# Altium schematic sheet Bullseye Volume Board Rev 0.0.3.SchDoc
size A4; DrawnBy: Kevin Zhou; Revision: 0.0.3; Status: DP1; Size: A4
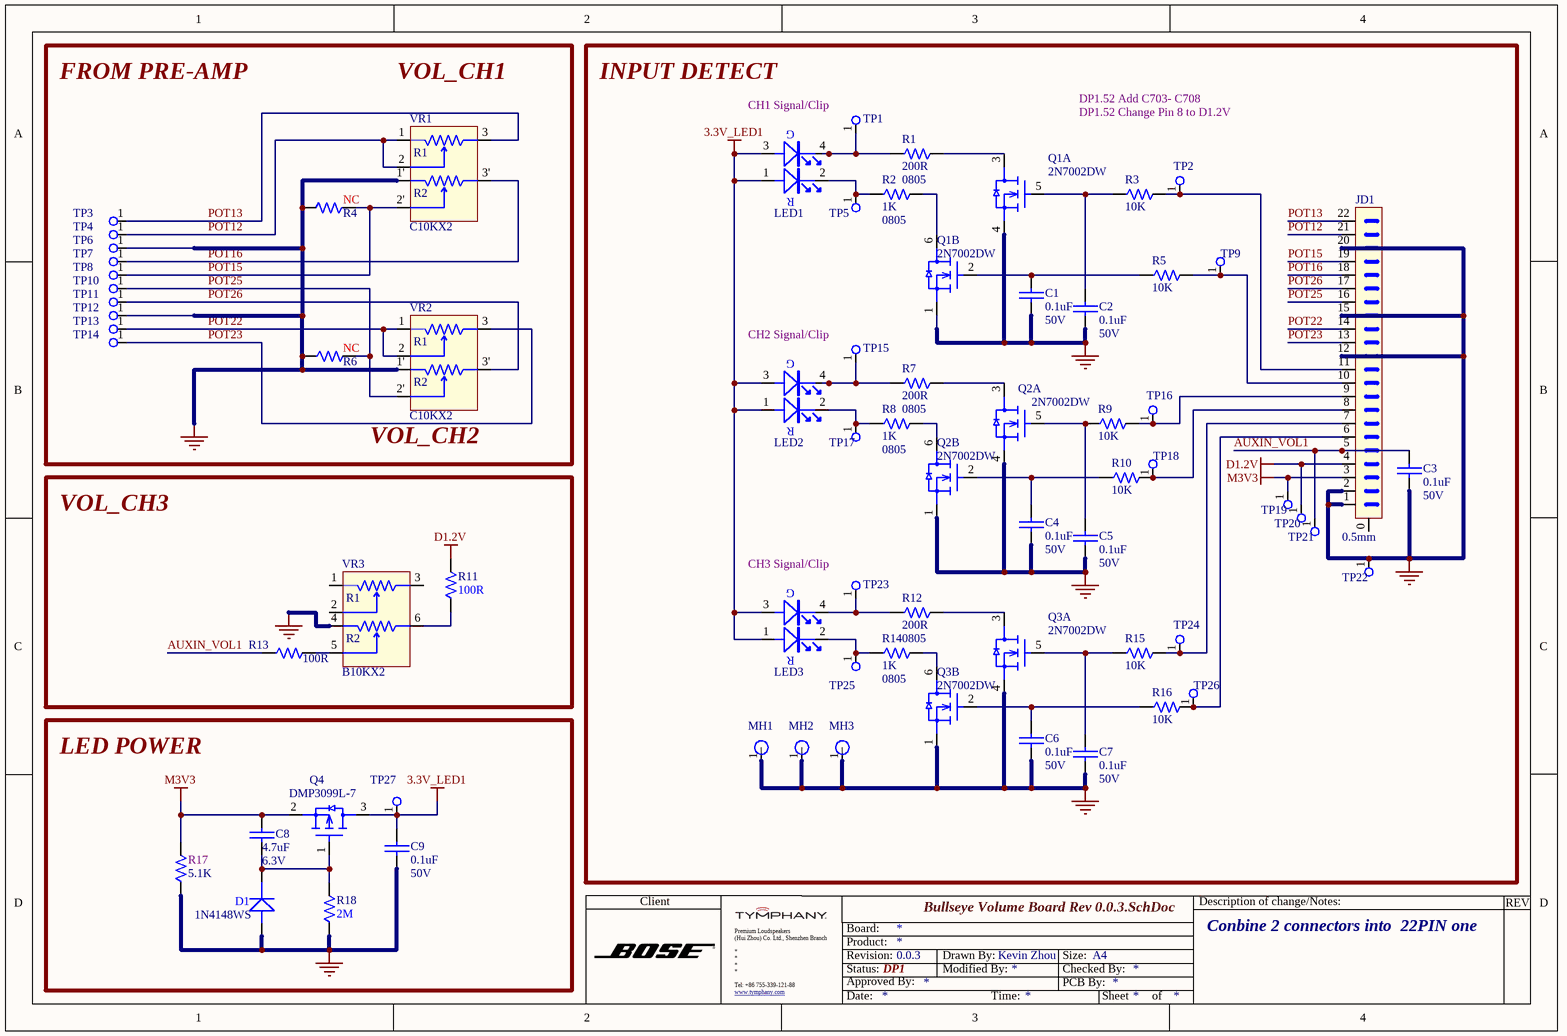
[diagram p0: Bullseye Volume Board Rev 0.0.3.SchDoc]

## Parts
C1  value 0.1uF  Voltage: 50V  [CAPC0402-RW]  (hidden comment: PWL456470-1040)
C2  value 0.1uF  Voltage: 50V  [CAPC0402-RW]  (hidden comment: PWL456470-1040)
C3  value 0.1uF  Voltage: 50V  [CAPC0402-RW]  (hidden comment: PWL456470-1040)
C4  value 0.1uF  Voltage: 50V  [CAPC0402-RW]  (hidden comment: PWL456470-1040)
C5  value 0.1uF  Voltage: 50V  [CAPC0402-RW]  (hidden comment: PWL456470-1040)
C6  value 0.1uF  Voltage: 50V  [CAPC0402-RW]  (hidden comment: PWL456470-1040)
C7  value 0.1uF  Voltage: 50V  [CAPC0402-RW]  (hidden comment: PWL456470-1040)
C8  value 4.7uF  Voltage: 6.3V  [CAPC0603-RW]  (hidden comment: PXL456420-4750)
C9  value 0.1uF  Voltage: 50V  [CAPC0603-RW]  (hidden comment: PXL456470-1040)
D1  RCD114148-0020  [SOD-323]  (value not drawn)
JD1  value 0.5mm  [CONN FFC 22P PH=0.5mm SMT RA 0.5S-1X-22PWT-5.4R]  (hidden comment: T690300139200)
LED1  KCD250001-0010  [SMTLED2.0*1.25-RGB]  (value not drawn)
LED2  KCD250001-0010  [SMTLED2.0*1.25-RGB]  (value not drawn)
LED3  KCD250001-0010  [SMTLED2.0*1.25-RGB]  (value not drawn)
MH1  MHOLE 3MM  [MHOLE 3.5MM W/Vias]  (value not drawn)
MH2  MHOLE 3MM  [MHOLE 3.5MM W/Vias]  (value not drawn)
MH3  MHOLE 3MM  [MHOLE 3.5MM W/Vias]  (value not drawn)
Q1  RCM027002-1001  [SOT-363]  (value not drawn)  (parts A,B of 2)
Q2  RCM027002-1001  [SOT-363]  (value not drawn)  (parts A,B of 2)
Q3  RCM027002-1001  [SOT-363]  (value not drawn)  (parts A,B of 2)
Q4  T585002550438  [SOT23-132-RW]  (value not drawn)
R1  value 200R  PACKAGE: 0805  [0805-RW]  (hidden comment: QCF081020-2000)
R2  value 1K  PACKAGE: 0805  [0805-RW]  (hidden comment: QCF081020-1001)
R3  value 10K  [0402-RW]  (hidden comment: QCF161240-1002)
R4  value NC  [0603-RW]  (hidden comment: RES0603 NC)
R5  value 10K  [0402-RW]  (hidden comment: QCF161240-1002)
R6  value NC  [0603-RW]  (hidden comment: RES0603 NC)
R7  value 200R  PACKAGE: 0805  [0805-RW]  (hidden comment: QCF081020-2000)
R8  value 1K  PACKAGE: 0805  [0805-RW]  (hidden comment: QCF081020-1001)
R9  value 10K  [0402-RW]  (hidden comment: QCF161240-1002)
R10  value 10K  [0402-RW]  (hidden comment: QCF161240-1002)
R11  value 100R  [0402-RW]  (hidden comment: QCF161240-1000)
R12  value 200R  PACKAGE: 0805  [0805-RW]  (hidden comment: QCF081020-2000)
R13  value 100R  [0402-RW]  (hidden comment: QCF161240-1000)
R14  value 1K  PACKAGE: 0805  [0805-RW]  (hidden comment: QCF081020-1001)
R15  value 10K  [0402-RW]  (hidden comment: QCF161240-1002)
R16  value 10K  [0402-RW]  (hidden comment: QCF161240-1002)
R17  value 5.1K  [0603-RW]  (hidden comment: QCF011030-5101)
R18  value 2M  [0402-RW]  (hidden comment: T502200401399)
TP1  CH1_GN  [TP_1.2mm]  (value not drawn)
TP2  CH1_SIG  [TP_1.2mm]  (value not drawn)
TP3  CH1_GN  [TP_1.2mm]  (value not drawn)
TP4  CH1_GN  [TP_1.2mm]  (value not drawn)
TP5  CH1_RED  [TP_1.2mm]  (value not drawn)
TP6  CH1_GN  [TP_1.2mm]  (value not drawn)
TP7  CH1_GN  [TP_1.2mm]  (value not drawn)
TP8  CH1_GN  [TP_1.2mm]  (value not drawn)
TP9  CH1_LIM  [TP_1.2mm]  (value not drawn)
TP10  CH1_GN  [TP_1.2mm]  (value not drawn)
TP11  CH1_GN  [TP_1.2mm]  (value not drawn)
TP12  CH1_GN  [TP_1.2mm]  (value not drawn)
TP13  CH1_GN  [TP_1.2mm]  (value not drawn)
TP14  CH1_GN  [TP_1.2mm]  (value not drawn)
TP15  CH1_GN  [TP_1.2mm]  (value not drawn)
TP16  CH1_SIG  [TP_1.2mm]  (value not drawn)
TP17  CH1_RED  [TP_1.2mm]  (value not drawn)
TP18  CH1_LIM  [TP_1.2mm]  (value not drawn)
TP19  CH1_LIM  [TP_1.2mm]  (value not drawn)
TP20  CH1_LIM  [TP_1.2mm]  (value not drawn)
TP21  CH1_LIM  [TP_1.2mm]  (value not drawn)
TP22  CH1_LIM  [TP_1.2mm]  (value not drawn)
TP23  CH1_GN  [TP_1.2mm]  (value not drawn)
TP24  CH1_SIG  [TP_1.2mm]  (value not drawn)
TP25  CH1_RED  [TP_1.2mm]  (value not drawn)
TP26  CH1_LIM  [TP_1.2mm]  (value not drawn)
TP27  CH2_SIG  [TP_1.2mm]  (value not drawn)
VR1  value C10KX2  [R11122G-FA20B7-5C103-167]  (hidden comment: T531230000320)
VR2  value C10KX2  [R11122G-FA20B7-5C103-167]  (hidden comment: T531230000320)
VR3  value B10KX2  [RV112BCF-40-20A-B10K-0C]  (hidden comment: T531220000419)

## Blocks framed on the sheet
INPUT DETECT: C1-C7 JD1 LED1-LED3 MH1-MH3 Q1-Q3 R1-R3 R5 R7-R10 R12 R14-R16 TP1 TP2 TP5 TP9 TP15-TP26
VOL_CH3: R11 R13 VR3
LED POWER: C8 C9 D1 Q4 R17 R18 TP27

## Nets
3.3V_LED1: C9.2 LED1.1 LED1.3 LED2.1 LED2.3 LED3.1 LED3.3 Q4.3(D) TP27.1
D1.2V: JD1.4 R11.2 TP20.1
GND: C1.2 C2.2 C3.2 C4.2 C5.2 C6.2 C7.2 C9.1 D1.1(A) JD1.1 JD1.2 JD1.12 JD1.15 JD1.20 MH1.1 MH2.1 MH3.1 Q1.1(S) Q1.4(S) Q2.1(S) Q2.4(S) Q3.1(S) Q3.4(S) R4.2 R6.1 R17.1 R18.1 TP6.1 TP12.1 TP22.1 VR1.1' VR2.1' VR3.4
M3V3: C8.1 JD1.3 Q4.2(S) R17.2 TP19.1
AUXIN_VOL1: C3.1 JD1.5 R13.1 TP21.1
POT12: JD1.21 TP4.1 VR1.1 VR1.2
POT13: JD1.22 TP3.1 VR1.3
POT15: JD1.19 R4.1 TP8.1 VR1.2'
POT16: JD1.18 TP7.1 VR1.3'
POT22: JD1.14 TP13.1 VR2.1 VR2.2
POT23: JD1.13 TP14.1 VR2.3
POT25: JD1.16 R6.2 TP10.1 VR2.2'
POT26: JD1.17 TP11.1 VR2.3'
NetC1_1: C1.1 Q1.2(G) R5.1
NetC2_1: C2.1 Q1.5(G) R3.1
NetC4_1: C4.1 Q2.2(G) R10.1
NetC5_1: C5.1 Q2.5(G) R9.1
NetC6_1: C6.1 Q3.2(G) R16.1
NetC7_1: C7.1 Q3.5(G) R15.1
NetC8_2: C8.2 D1.2(K) Q4.1(G) R18.2
NetJD1_6: JD1.6 R16.2 TP26.1
NetJD1_7: JD1.7 R15.2 TP24.1
NetJD1_8: JD1.8 R10.2 TP18.1
NetJD1_9: JD1.9 R9.2 TP16.1
NetJD1_10: JD1.10 R5.2 TP9.1
NetJD1_11: JD1.11 R3.2 TP2.1
NetLED1_2: LED1.2 R2.1 TP5.1
NetLED1_4: LED1.4 R1.1 TP1.1
NetLED2_2: LED2.2 R8.1 TP17.1
NetLED2_4: LED2.4 R7.1 TP15.1
NetLED3_2: LED3.2 R14.1 TP25.1
NetLED3_4: LED3.4 R12.1 TP23.1
NetQ1_3: Q1.3(D) R1.2
NetQ1_6: Q1.6(D) R2.2
NetQ2_3: Q2.3(D) R7.2
NetQ2_6: Q2.6(D) R8.2
NetQ3_3: Q3.3(D) R12.2
NetQ3_6: Q3.6(D) R14.2
NetR11_1: R11.1 VR3.6
NetR13_2: R13.2 VR3.5

Not connected (* = marked no-connect by the designer): JD1 0; VR3 1 2 3

## Notes on the sheet
- FROM PRE-AMP
- VOL_CH1
- (near TP1) CH1 Signal/Clip
- DP1.52 Add C703- C708
- DP1.52 Change Pin 8 to D1.2V
- (near TP15) CH2 Signal/Clip
- (near VR2) VOL_CH2
- (near TP23) CH3 Signal/Clip
- Conbine 2 connectors into  22PIN one
- Client
- Description of change/Notes:
- REV
- Premium Loudspeakers
- (Hui Zhou) Co. Ltd., Shenzhen Branch
- Tel: +86 755-339-121-88
- Status:
- Revision:
- Approved By:
- Board:
- Product:
- Drawn By:
- Modified By:
- PCB By:
- Checked By:
- Size:
- www.tymphany.com <http://www.tymphany.com>
- Date:
- Time:
- Sheet
- of
- (in symbol MS-PTB2012CURSGAC) G; R
- (in symbol R11122G-FA20B7-5C103-167) R1; R2
- (in symbol RV112BCF-40-20A-B10K-0C) R1; R2

## Library data of the parts
C1-C7 = CAP0402 0.1uF 50V 10%: CAP, CER, 0.1uF, 10%, 50V, X7R, 0402, RoHS; SAP: T542011047508; Type: Capacitor; CREATE_NAME: TOM@Deftronics; PACKAGE: CAPC0402; Vendor Name: *; MFG: *; MFG Part: *; Other: X7R; Tolerance: 10%; CREATE_TIME: 13-May-2014
C8 = CAP0603 4.7uF 6.3V 10% - Walsin: CHIP CAP 4.7uF 6.3V 10% 0603 TYPE X7R; SAP: T542024757108; Vendor Name: 华新科技股份有限公司; MFG: Walsin; Type: Capacitor; PACKAGE: CAPC0603; MFG Part: *; Other: X7R; Tolerance: 10%
C9 = CAP0603 0.1uF 50V 10% - PXL456470-1040: GP CHIP CAP 0.1uF 50V 10% 0603 TYPE X7R; SAP: T542021047508; Vendor Code: 10010262; Vendor Name: ???????????; Type: Capacitor; PACKAGE: CAPC0603; MFG: *; MFG Part: *; Other: X7R; Tolerance: 10%
D1 = 1N4148WS: DIODE SW 1N4148 VF=0.7V SOD-323; MFG: TW SEMICONDUCTOR; SAP: T572005070208; Voltage: 100V; Current: 150MA; Vendor Name: *; Vendor Code: *; Type: DIODE; Package: SOD-323; MFG Part: 1N4148WS
JD1 = CONN FFC 22P PH=0.5mm SMT RA 0.5S-1X-22PWT-5.4R: 22P P=0.5MM 180 K; MFG: 金佳; CREATE_NAME: Nathan; DIP&SMD: SMD; Vendor Code: *; Vendor Name: *; TYPE: Connector; CREATE_TIME: 26-Apr-2018; SAP: T690300139200; MFG Part: 0.5S-1X-22PWT-5.4R; Current: *
LED1-LED3 = MS-PTB2012CURSGAC: SMD LED 2.0x1.25mm MS-PTB2012CURSGAC  RED/GREEN; SAP: T575009550253; MFG: MASON; CREATE_NAME: TOM@Deftronics; MFG Part: MS-PTB2012CURSGAC  RED/GREEN; Vendor Code: *; Vendor Name: *; Type: LED; CREATE_TIME: 22-Sep-2013
MH1-MH3 = MHOLE 3MM: MOUNTING HOLE FOR 3MM SCREW; DIP&SMD: DIP; TYPE: SCREW HOLE; VALUE: 3mm; Customer Specific: N/A
Q1-Q3 = 2N7002DW: SMD MOSFET N-CH SOT-363 2N7002DW      Fairchild; SAP: T586002602738; CREATE_NAME: Evan@Deftronics; MFG: Fairchild; Vendor Name: *; Vendor Code: *; Voltage: *; Current: *; Type: MOSFET; CREATE_TIME: 7-May-2014; MFG_Part: 2N7002DW
Q4 = DMP3099L-7: PMOS 20V DMP3099L-7 SOT23 DIODES K; MFG: DIODES  (ZETEX); CREATE_NAME: Nathan; DIP&SMD: SMD; SAP: T585002550438; Vendor Code: *; Vendor Name: *; Power: *; Voltage: *; Type: PMOS; Package: SOT-23; CREATE_TIME: 25-Nov-2018; MFG Part: DMP3099L-7; Customer Specific: N/A
R1 R7 R12 = RES0805 1/8W 1% 200 OHM: GP CHIP RES. 200 OHM 1/8W 1% 0805; Vendor Code: 10010262; SAP: T502200003399; Vendor Name: 东莞市晴远电子有限公司; Power: *; MFG Part: *; MFG: *; TOL: 1%; Type: Resistor
R2 R8 R14 = RES0805 1/8W 1% 1K OHM: GP CHIP RES. 1K OHM 1/8W 1% 0805; Vendor Code: 10010262; SAP: T502100103399; Vendor Name: 东莞市晴远电子有限公司; Power: *; MFG Part: *; MFG: *; TOL: 1%; Type: Resistor
R3 R5 R9 R10 R15 R16 = RES0402 1/16W 1% 10K OHM: CHIP RES 10K OHM 1/16W 1% 0402; SAP: T502100201399; MFG: WALSIN; Vendor Code: *; Power: *; Vendor Name: *; MFG Part: *; TOL: 1%; Type: Resistor; PACKAGE: 0402
R4 R6 = RES0603 NC: NC; CREATE_NAME: Tom; DIP&SMD: SMD; SAP: *; Tolerance: *; MFG Part: *; MFG: *; Vendor Code: *; Vendor Name: *; Type: Resistor; Power: *; CREATE_TIME: 18-Mar-2016; Customer Specific: N/A; Package: 0603
R11 = RES0402 1/16W 1% 100 OHM: CHIP RES 100 OHM 1/16W 1% 0402; SAP: T502100001399; MFG: WALSIN; Vendor Code: *; Power: *; Vendor Name: *; MFG Part: *; TOL: 1%; Type: Resistor; PACKAGE: 0402
R13 = RES0402 1/16W 1% 100 OHM: CHIP RES 100 OHM 1/16W 1% 0402; SAP: T502100001399; MFG: WALSIN; DIP&SMD: SMD; Vendor Code: *; Power: 1/16W; Vendor Name: *; MFG Part: *; TOL: 1%; Type: Resistor; PACKAGE: 0402; Customer Specific: N/A
R17 = RES0603 1/10W 1% 5.1K OHM: GP CHIP RES. 5.1K OHM 1/10W 1% 0603; Vendor Code: 10010262; SAP: T502510102399; Vendor Name: 东莞市晴远电子有限公司; Power: *; MFG Part: *; MFG: *; TOL: 1%; Type: Resistor; PACKAGE: 0603
R18 = RES0402 1/16W 1% 2M OMH_WALSIN: CHIP 2M OHM    100PPM +-1% 0402 WALS L; TOL: 1%; MFG: WALSIN (華新); Power: 1/16W; CREATE_NAME: Nathan; SAP: T502200401399; Package: 0402; MFG Part: *; Vendor Code: *; Vendor Name: *; Type: Resistor; CREATE_TIME: 25-May-2016
TP1-TP27 = TP
VR1 VR2 = R11122G-FA20B7-5C103-167: VR CA 10K C L=20MM R11122G-F K; MFG: IDEAL; CREATE_NAME: Nathan; DIP&SMD: DIP; SAP: T531230000320; Vendor Code: *; Vendor Name: *; Type: Potentiometer; CREATE_TIME: 13-Oct-2017; MFG Part: R11122G-FA20B7-5C103-167
VR3 = RV112BCF-40-20A-B10K-0C: VR CA 10K B 15.4X13MM RV112BCF- K; MFG: ALPHA    (東莞艾華電子); CREATE_NAME: Nathan; DIP&SMD: DIP; SAP: T531220000419; Vendor Code: *; Vendor Name: *; Type: Potentiometer; CREATE_TIME: 13-Oct-2017; MFG Part: RV112BCF-40-20A-B10K-0C